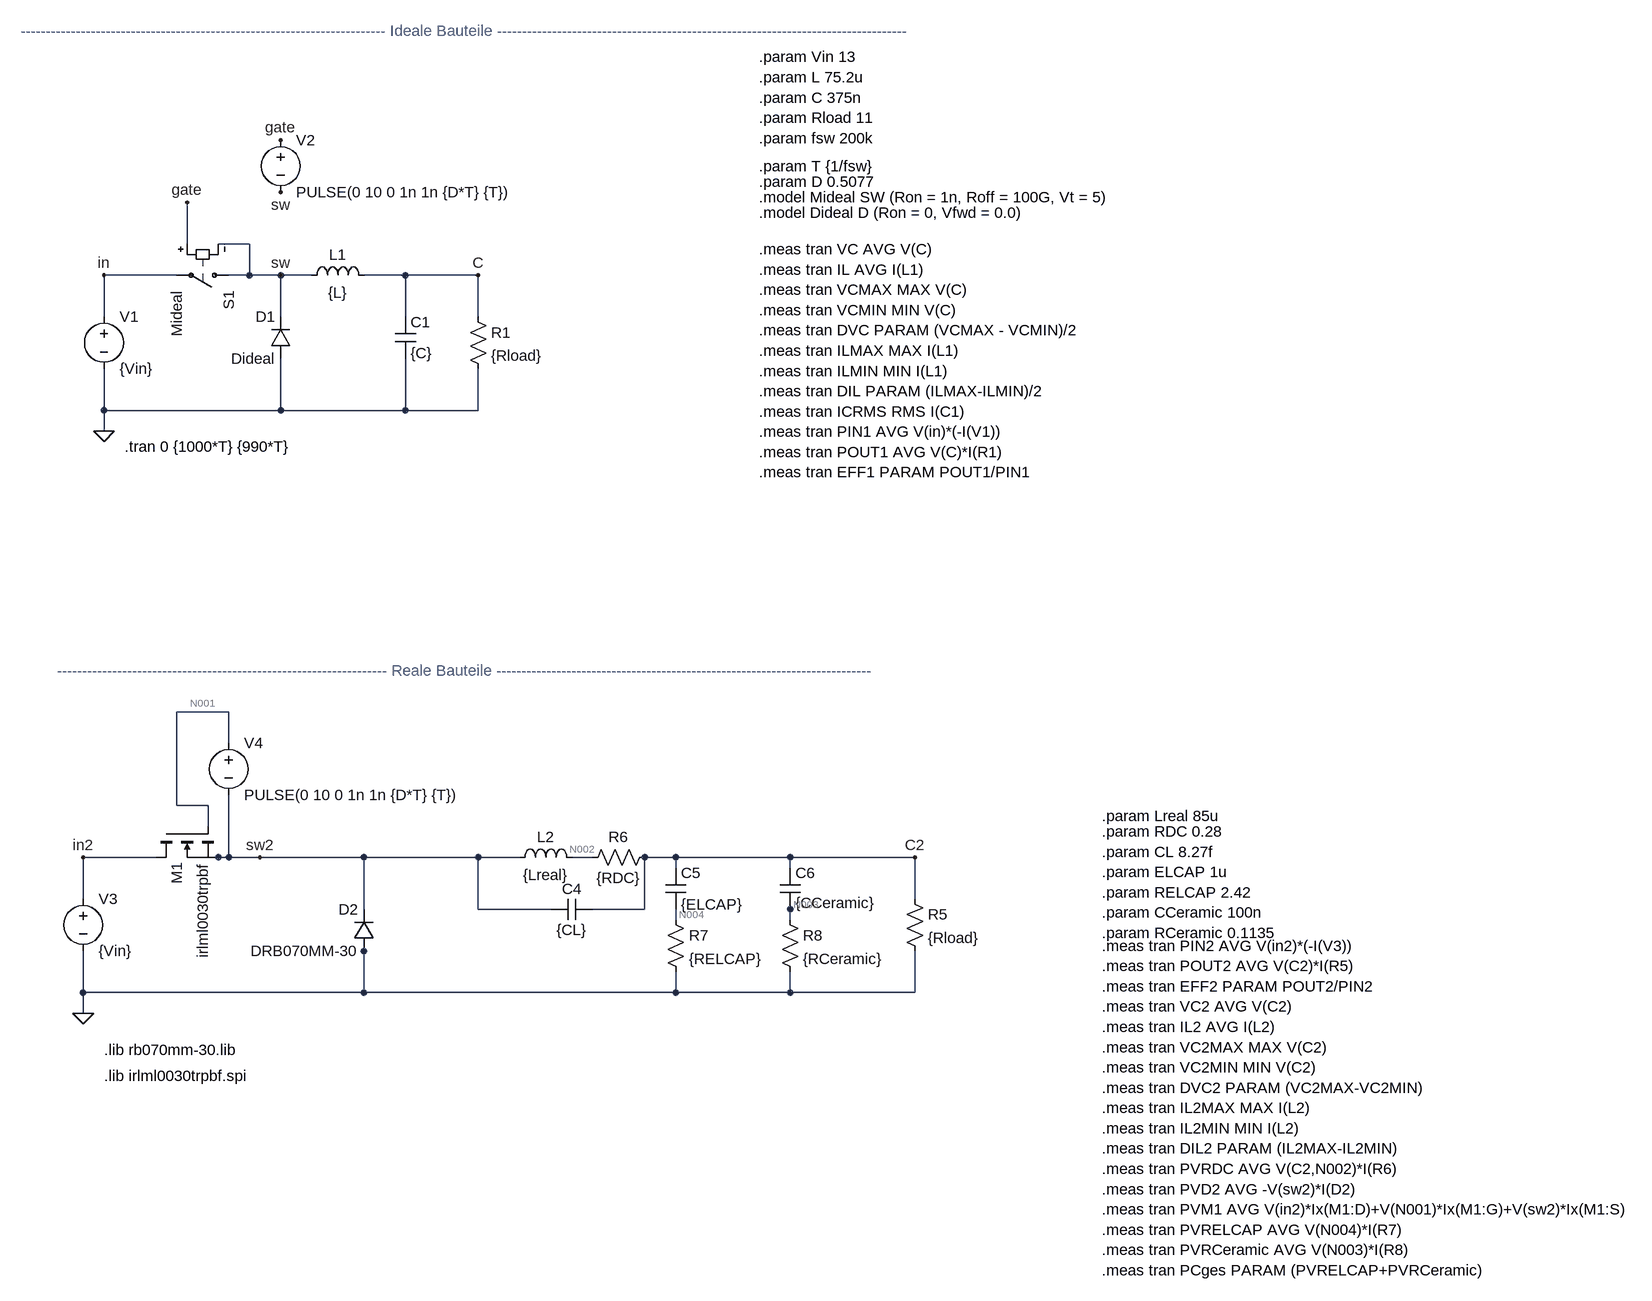
[diagram p0: schematic Buck Converter Real.asc]
Buck Converter Real.asc, the LTspice schematic file:
Version 4
SHEET 1 2448 1592
WIRE 80 48 80 -16
WIRE 176 48 128 48
WIRE 64 96 -48 96
WIRE 176 96 176 48
WIRE 176 96 144 96
WIRE 224 96 176 96
WIRE 272 96 224 96
WIRE 416 96 352 96
WIRE 528 96 416 96
WIRE -48 160 -48 96
WIRE 224 160 224 96
WIRE 416 160 416 96
WIRE 528 160 528 96
WIRE -48 304 -48 240
WIRE 224 304 224 224
WIRE 224 304 -48 304
WIRE 416 304 416 224
WIRE 416 304 224 304
WIRE 528 304 528 240
WIRE 528 304 416 304
WIRE -48 336 -48 304
WIRE 144 768 64 768
WIRE 144 816 144 768
WIRE 64 912 64 768
WIRE 112 912 64 912
WIRE 112 944 112 912
WIRE 32 992 -80 992
WIRE 128 992 112 992
WIRE 144 992 144 896
WIRE 144 992 128 992
WIRE 192 992 144 992
WIRE 352 992 192 992
WIRE 528 992 352 992
WIRE 592 992 528 992
WIRE 704 992 672 992
WIRE 832 992 784 992
WIRE 1008 992 832 992
WIRE 1200 992 1008 992
WIRE 832 1008 832 992
WIRE 1008 1008 1008 992
WIRE -80 1056 -80 992
WIRE 1200 1056 1200 992
WIRE 352 1072 352 992
WIRE 528 1072 528 992
WIRE 640 1072 528 1072
WIRE 784 1072 784 992
WIRE 784 1072 704 1072
WIRE 1008 1072 1008 1056
WIRE 832 1088 832 1072
WIRE 1008 1088 1008 1072
WIRE 352 1136 352 1120
WIRE -80 1200 -80 1136
WIRE 352 1200 352 1136
WIRE 352 1200 -80 1200
WIRE 832 1200 832 1168
WIRE 832 1200 352 1200
WIRE 1008 1200 1008 1168
WIRE 1008 1200 832 1200
WIRE 1200 1200 1200 1136
WIRE 1200 1200 1008 1200
WIRE -80 1232 -80 1200
FLAG -48 336 0
FLAG 528 96 C
FLAG -48 96 in
FLAG 224 96 sw
FLAG 80 -16 gate
FLAG 224 -112 gate
FLAG 224 -32 sw
FLAG -80 1232 0
FLAG 1200 992 C2
FLAG -80 992 in2
FLAG 192 992 sw2
SYMBOL voltage -48 144 R0
SYMATTR InstName V1
SYMATTR Value {Vin}
SYMBOL diode 240 224 R180
WINDOW 0 24 64 Left 2
WINDOW 3 24 0 Left 2
SYMATTR InstName D1
SYMATTR Value Dideal
SYMBOL res 512 144 R0
SYMATTR InstName R1
SYMATTR Value {Rload}
SYMBOL sw 160 96 R90
SYMATTR InstName S1
SYMATTR Value Mideal
SYMBOL voltage 224 -128 R0
WINDOW 123 0 0 Left 0
WINDOW 39 0 0 Left 0
SYMATTR InstName V2
SYMATTR Value PULSE(0 10 0 1n 1n {D*T} {T})
SYMBOL voltage -80 1040 R0
SYMATTR InstName V3
SYMATTR Value {Vin}
SYMBOL diode 368 1136 R180
WINDOW 0 24 64 Left 2
WINDOW 3 24 0 Left 2
SYMATTR InstName D2
SYMATTR Value DRB070MM-30
SYMBOL ind 576 1008 R270
WINDOW 0 32 56 VTop 2
WINDOW 3 5 56 VBottom 2
SYMATTR InstName L2
SYMATTR Value {Lreal}
SYMBOL res 1184 1040 R0
SYMATTR InstName R5
SYMATTR Value {Rload}
SYMBOL voltage 144 800 R0
WINDOW 123 0 0 Left 0
WINDOW 39 0 0 Left 0
SYMATTR InstName V4
SYMATTR Value PULSE(0 10 0 1n 1n {D*T} {T})
SYMBOL res 800 976 R90
WINDOW 0 0 56 VBottom 2
WINDOW 3 32 56 VTop 2
SYMATTR InstName R6
SYMATTR Value {RDC}
SYMBOL cap 704 1056 R90
WINDOW 0 0 32 VBottom 2
WINDOW 3 32 32 VTop 2
SYMATTR InstName C4
SYMATTR Value {CL}
SYMBOL cap 816 1008 R0
SYMATTR InstName C5
SYMATTR Value {ELCAP}
SYMBOL res 816 1072 R0
SYMATTR InstName R7
SYMATTR Value {RELCAP}
SYMBOL cap 992 1008 R0
WINDOW 3 24 54 Left 2
SYMATTR Value {CCeramic}
SYMATTR InstName C6
SYMBOL res 992 1072 R0
SYMATTR InstName R8
SYMATTR Value {RCeramic}
SYMBOL cap 400 160 R0
SYMATTR InstName C1
SYMATTR Value {C}
SYMBOL nmos 32 944 M90
SYMATTR InstName M1
SYMATTR Value irlml0030trpbf
SYMATTR Prefix X
SYMBOL ind 256 112 R270
WINDOW 0 32 56 VTop 2
WINDOW 3 5 56 VBottom 2
SYMATTR InstName L1
SYMATTR Value {L}
TEXT 960 -240 Left 2 !.param Vin 13\n.param L 75.2u\n.param C 375n\n.param Rload 11\n.param fsw 200k
TEXT 960 -72 Left 2 !.param T {1/fsw}
TEXT 960 0 Left 2 !.model Dideal D (Ron = 0, Vfwd = 0.0)
TEXT 960 -24 Left 2 !.model Mideal SW (Ron = 1n, Roff = 100G, Vt = 5)
TEXT 960 -48 Left 2 !.param D 0.5077
TEXT 960 56 Left 2 !.meas tran VC AVG V(C)\n.meas tran IL AVG I(L1)\n.meas tran VCMAX MAX V(C)\n.meas tran VCMIN MIN V(C)\n.meas tran DVC PARAM (VCMAX - VCMIN)/2\n.meas tran ILMAX MAX I(L1)\n.meas tran ILMIN MIN I(L1)\n.meas tran DIL PARAM (ILMAX-ILMIN)/2\n.meas tran ICRMS RMS I(C1)\n.meas tran PIN1 AVG V(in)*(-I(V1))\n.meas tran POUT1 AVG V(C)*I(R1)\n.meas tran EFF1 PARAM POUT1/PIN1
TEXT -16 360 Left 2 !.tran 0 {1000*T} {990*T}
TEXT 1488 952 Left 2 !.param RDC 0.28\n.param CL 8.27f\n.param ELCAP 1u\n.param RELCAP 2.42\n.param CCeramic 100n\n.param RCeramic 0.1135
TEXT -176 -280 Left 2 ;------------------------------------------------------------------------- Ideale Bauteile ----------------------------------------------------------------------------------
TEXT -120 704 Left 2 ;------------------------------------------------------------------ Reale Bauteile ---------------------------------------------------------------------------
TEXT 1488 928 Left 2 !.param Lreal 85u
TEXT -48 1288 Left 2 !.lib rb070mm-30.lib
TEXT -48 1328 Left 2 !.lib irlml0030trpbf.spi
TEXT 1488 1128 Left 2 !.meas tran PIN2 AVG V(in2)*(-I(V3))\n.meas tran POUT2 AVG V(C2)*I(R5)\n.meas tran EFF2 PARAM POUT2/PIN2\n.meas tran VC2 AVG V(C2)\n.meas tran IL2 AVG I(L2)\n.meas tran VC2MAX MAX V(C2)\n.meas tran VC2MIN MIN V(C2)\n.meas tran DVC2 PARAM (VC2MAX-VC2MIN)\n.meas tran IL2MAX MAX I(L2)\n.meas tran IL2MIN MIN I(L2)\n.meas tran DIL2 PARAM (IL2MAX-IL2MIN)\n.meas tran PVRDC AVG V(C2,N002)*I(R6)\n.meas tran PVD2 AVG -V(sw2)*I(D2)\n.meas tran PVM1 AVG V(in2)*Ix(M1:D)+V(N001)*Ix(M1:G)+V(sw2)*Ix(M1:S)\n.meas tran PVRELCAP AVG V(N004)*I(R7)\n.meas tran PVRCeramic AVG V(N003)*I(R8)\n.meas tran PCges PARAM (PVRELCAP+PVRCeramic)

The netlist it stands for:
* Buck Converter Real.asc
V1 in 0 {Vin}
D1 0 sw Dideal
R1 C 0 {Rload}
S1 sw in gate sw Mideal
V2 gate sw PULSE(0 10 0 1n 1n {D*T} {T})
V3 in2 0 {Vin}
D2 0 sw2 DRB070MM-30
L2 sw2 N002 {Lreal}
R5 C2 0 {Rload}
V4 N001 sw2 PULSE(0 10 0 1n 1n {D*T} {T})
R6 C2 N002 {RDC}
C4 C2 sw2 {CL}
C5 C2 N004 {ELCAP}
R7 N004 0 {RELCAP}
C6 C2 N003 {CCeramic}
R8 N003 0 {RCeramic}
C1 C 0 {C}
XM1 in2 N001 sw2 irlml0030trpbf  ; pins D G S
L1 sw C {L}
.model D D
.lib standard.dio
.param Vin 13
.param L 75.2u
.param C 375n
.param Rload 11
.param fsw 200k
.param T {1/fsw}
.model Dideal D (Ron = 0, Vfwd = 0.0)
.model Mideal SW (Ron = 1n, Roff = 100G, Vt = 5)
.param D 0.5077
.meas tran VC AVG V(C)
.meas tran IL AVG I(L1)
.meas tran VCMAX MAX V(C)
.meas tran VCMIN MIN V(C)
.meas tran DVC PARAM (VCMAX - VCMIN)/2
.meas tran ILMAX MAX I(L1)
.meas tran ILMIN MIN I(L1)
.meas tran DIL PARAM (ILMAX-ILMIN)/2
.meas tran ICRMS RMS I(C1)
.meas tran PIN1 AVG V(in)*(-I(V1))
.meas tran POUT1 AVG V(C)*I(R1)
.meas tran EFF1 PARAM POUT1/PIN1
.tran 0 {1000*T} {990*T}
.param RDC 0.28
.param CL 8.27f
.param ELCAP 1u
.param RELCAP 2.42
.param CCeramic 100n
.param RCeramic 0.1135
* ------------------------------------------------------------------------- Ideale Bauteile ----------------------------------------------------------------------------------
* ------------------------------------------------------------------ Reale Bauteile ---------------------------------------------------------------------------
.param Lreal 85u
.lib rb070mm-30.lib
.lib irlml0030trpbf.spi
.meas tran PIN2 AVG V(in2)*(-I(V3))
.meas tran POUT2 AVG V(C2)*I(R5)
.meas tran EFF2 PARAM POUT2/PIN2
.meas tran VC2 AVG V(C2)
.meas tran IL2 AVG I(L2)
.meas tran VC2MAX MAX V(C2)
.meas tran VC2MIN MIN V(C2)
.meas tran DVC2 PARAM (VC2MAX-VC2MIN)
.meas tran IL2MAX MAX I(L2)
.meas tran IL2MIN MIN I(L2)
.meas tran DIL2 PARAM (IL2MAX-IL2MIN)
.meas tran PVRDC AVG V(C2,N002)*I(R6)
.meas tran PVD2 AVG -V(sw2)*I(D2)
.meas tran PVM1 AVG V(in2)*Ix(M1:D)+V(N001)*Ix(M1:G)+V(sw2)*Ix(M1:S)
.meas tran PVRELCAP AVG V(N004)*I(R7)
.meas tran PVRCeramic AVG V(N003)*I(R8)
.meas tran PCges PARAM (PVRELCAP+PVRCeramic)
.backanno
.end

* Results of the author's LTspice run, read from the files saved beside the schematic
* Operating Point, zero values left out:
*   V(in) = 13 V
*   V(in2) = 13 V
*   V(sw2) = 1.467 µV
*   V(n002) = 1.467 µV
*   V(c2) = 1.43 µV
*   V(n001) = 1.467 µV
*   I(D2) = -42.69 pA
*   I(L1) = 143 pA
*   I(L2) = 130 nA
*   I(R6) = -130 nA
*   I(R5) = 130 nA
*   I(R1) = 143 pA
*   I(S1) = 143 pA
*   I(V4) = 13 pA
*   I(V3) = -130.1 nA
*   I(V1) = -143 pA
*   Ix(m1:1) = 130.1 nA
*   Ix(m1:2) = -13 pA
*   Ix(m1:3) = -130.1 nA
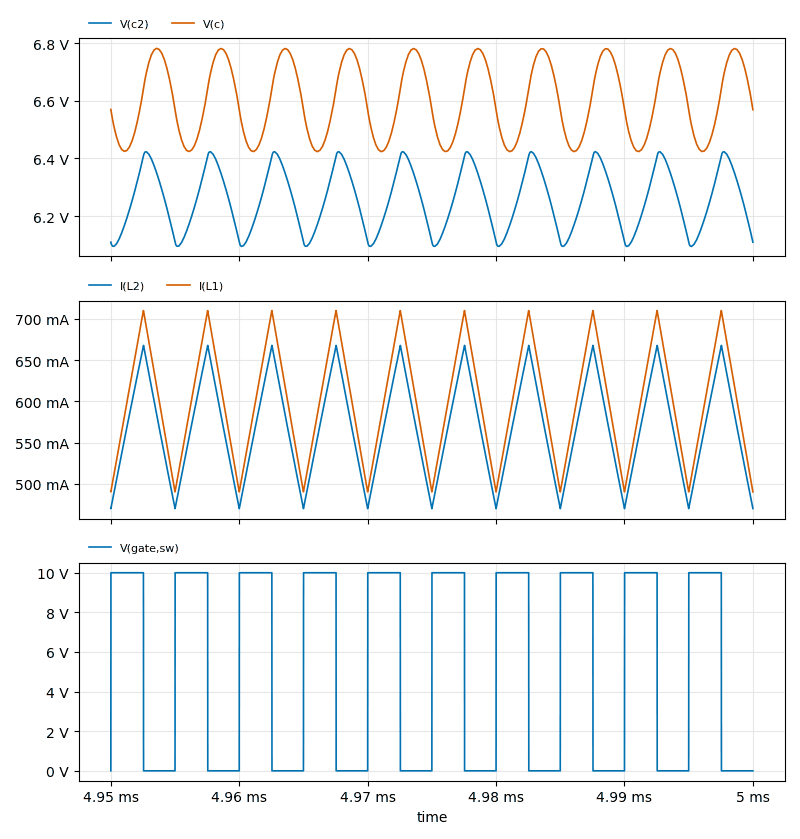
[diagram p1: Transient Analysis of Buck Converter Real.asc, plotted from the saved traces]
* Transient Analysis, 1 run:
*   V(c2): min 6.095 V, max 6.424 V, average 6.258 V, rms 6.259 V, last 6.109 V
*   V(c): min 6.424 V, max 6.782 V, average 6.602 V, rms 6.603 V, last 6.569 V
*   I(L2): min 469.9 mA, max 667.9 mA, average 568.9 mA, rms 571.8 mA, last 470 mA
*   I(L1): min 490.2 mA, max 710.2 mA, average 600.2 mA, rms 603.6 mA, last 490.2 mA
*   V(gate,sw): min 0 V, max 10 V, average 5.079 V, rms 7.126 V, last 0 V
* From the log:
*   vc: AVG(v(c))=6.60205 FROM 0 TO 5e-005
*   il: AVG(i(l1))=0.600179 FROM 0 TO 5e-005
*   vcmax: MAX(v(c))=6.78242 FROM 0 TO 5e-005
*   vcmin: MIN(v(c))=6.42379 FROM 0 TO 5e-005
*   dvc: (vcmax - vcmin)/2=0.179313
*   ilmax: MAX(i(l1))=0.710166 FROM 0 TO 5e-005
*   ilmin: MIN(i(l1))=0.490198 FROM 0 TO 5e-005
*   dil: (ilmax-ilmin)/2=0.109984
*   icrms: RMS(i(c1))=0.0625662 FROM 0 TO 5e-005
*   pin1: AVG(v(in)*(-i(v1)))=3.96442 FROM 0 TO 5e-005
*   pout1: AVG(v(c)*i(r1))=3.96398 FROM 0 TO 5e-005
*   eff1: pout1/pin1=0.999889
*   pin2: AVG(v(in2)*(-i(v3)))=3.77465 FROM 0 TO 5e-005
*   pout2: AVG(v(c2)*i(r5))=3.5616 FROM 0 TO 5e-005
*   eff2: pout2/pin2=0.943557
*   vc2: AVG(v(c2))=6.25828 FROM 0 TO 5e-005
*   il2: AVG(i(l2))=0.568934 FROM 0 TO 5e-005
*   vc2max: MAX(v(c2))=6.42367 FROM 0 TO 5e-005
*   vc2min: MIN(v(c2))=6.09467 FROM 0 TO 5e-005
*   dvc2: (vc2max-vc2min)=0.328998
*   il2max: MAX(i(l2))=0.667856 FROM 0 TO 5e-005
*   il2min: MIN(i(l2))=0.469901 FROM 0 TO 5e-005
*   dil2: (il2max-il2min)=0.197955
*   pvrdc: AVG(v(c2,n002)*i(r6))=0.0915492 FROM 0 TO 5e-005
*   pvd2: AVG(-v(sw2)*i(d2))=0.108894 FROM 0 TO 5e-005
*   pvm1: AVG(v(in2)*ix(m1:d)+v(n001)*ix(m1:g)+v(sw2)*ix(m1:s))=0.0171004 FROM 0 TO 5e-005
*   pvrelcap: AVG(v(n004)*i(r7))=0.00432138 FROM 0 TO 5e-005
*   pvrceramic: AVG(v(n003)*i(r8))=2.25971e-005 FROM 0 TO 5e-005
*   pcges: (pvrelcap+pvrceramic)=0.00434397